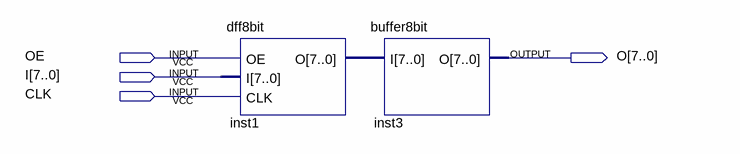
[diagram p0: schematic sheet]
// Quartus schematic pc8bit.bdf as structural Verilog: 2 symbols, 4 pins
module pc8bit (
  input  OE,
  input  [7:0] I,
  input  CLK,
  output [7:0] O
);

  wire [7:0] inst1_o;

  dff8bit inst1 (.OE(OE), .I(I), .CLK(CLK), .O(inst1_o));
  buffer8bit inst3 (.I(inst1_o), .O(O));
endmodule
